# EAGLE design Rpi3Shield (EAGLE 9.3.0)
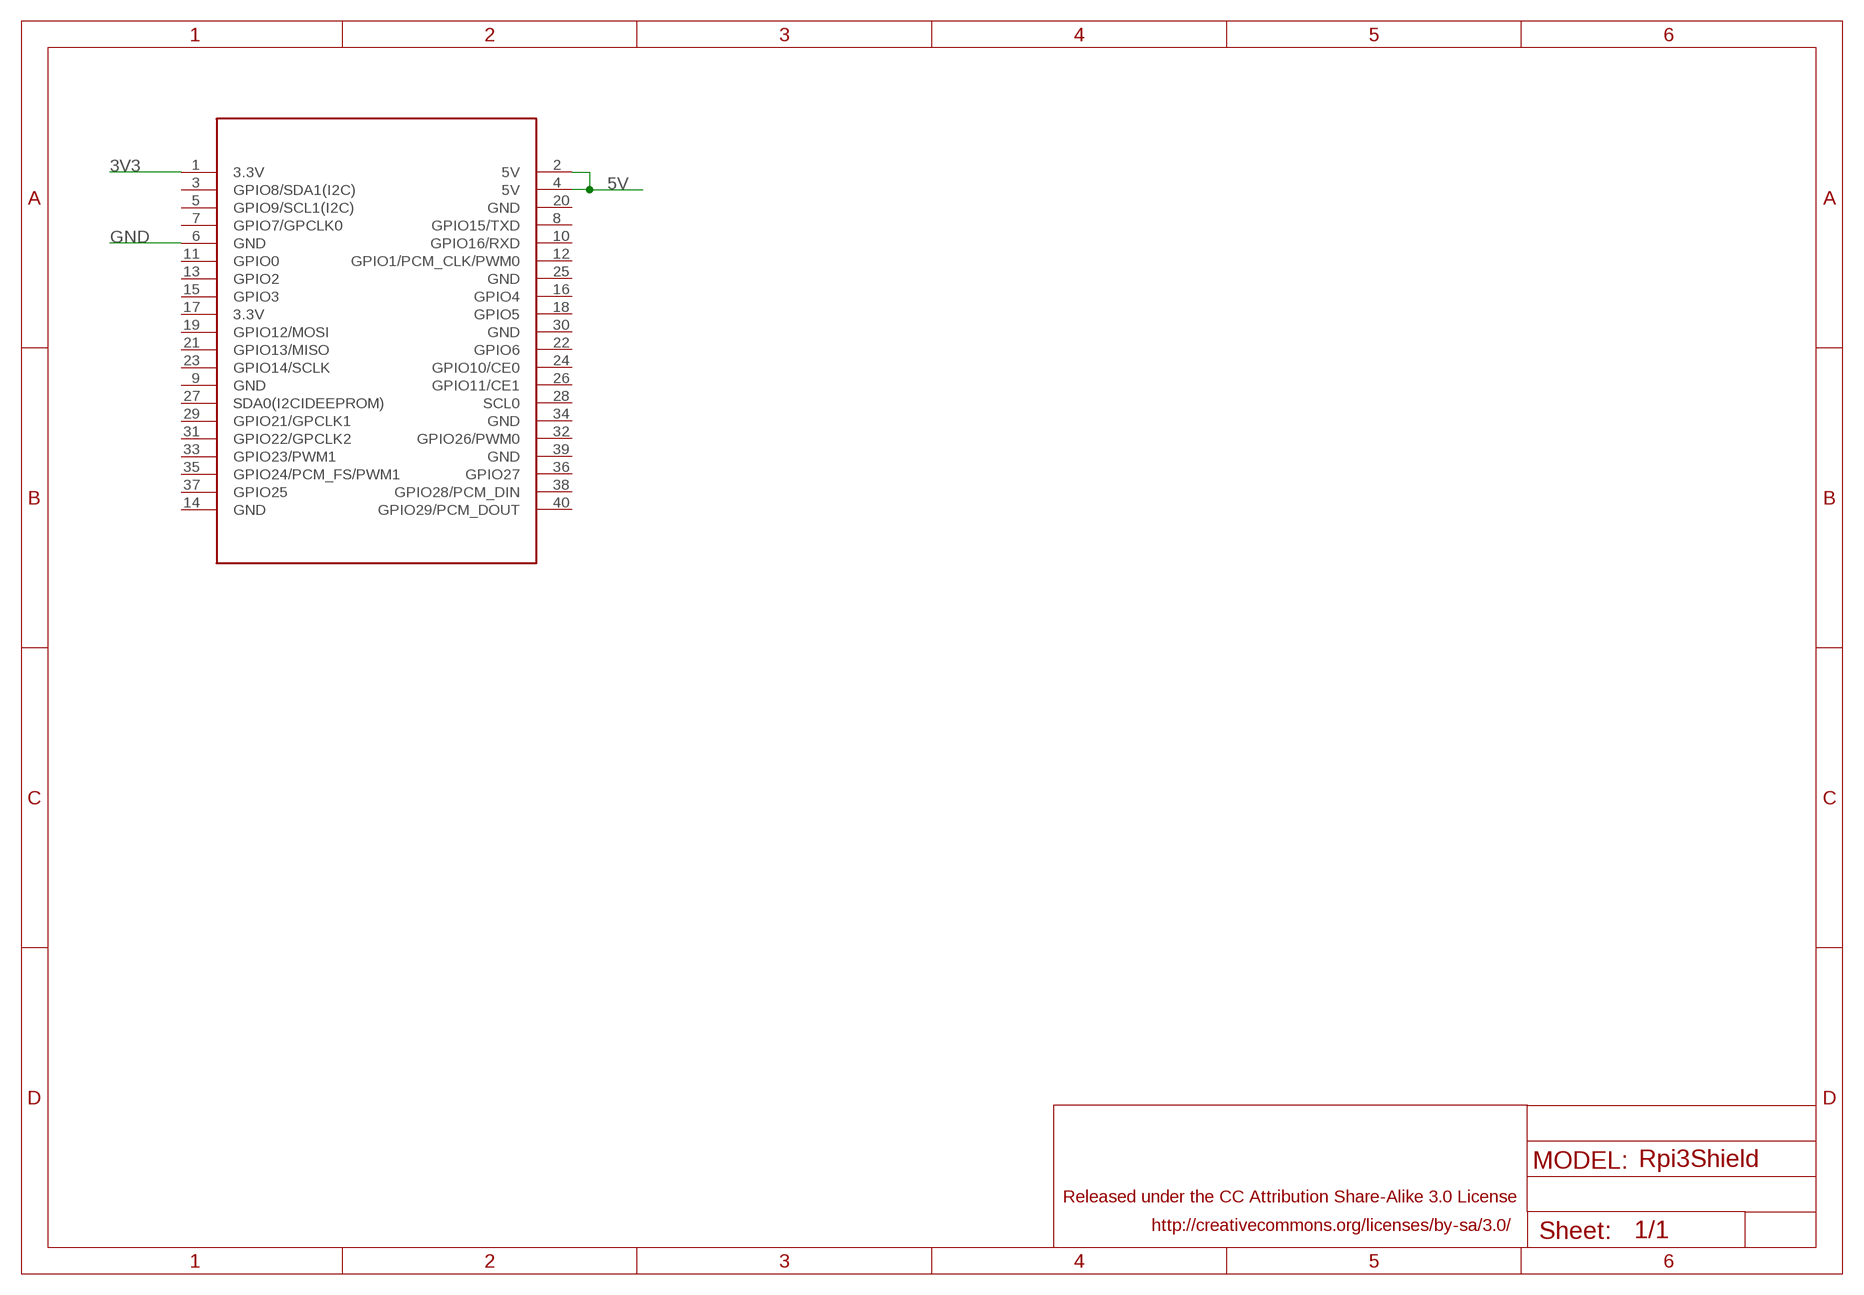
[diagram p0: schematic, sheet 1]

## Parts
U$2  RPILORASHIELD  [RPILORASHIELD]

## Nets
3V3: U$2.1(3.3V)
5V: U$2.2(5V) U$2.4(5V)
GND: U$2.6(GND)
Unconnected: U$2.3(GPIO8/SDA1(I2C)) U$2.5(GPIO9/SCL1(I2C)) U$2.7(GPIO7/GPCLK0) U$2.8(GPIO15/TXD) U$2.9(GND) U$2.10(GPIO16/RXD) U$2.11(GPIO0) U$2.12(GPIO1/PCM_CLK/PWM0) U$2.13(GPIO2) U$2.14(GND) U$2.15(GPIO3) U$2.16(GPIO4) U$2.17(3.3V) U$2.18(GPIO5) U$2.19(GPIO12/MOSI) U$2.20(GND) U$2.21(GPIO13/MISO) U$2.22(GPIO6) U$2.23(GPIO14/SCLK) U$2.24(GPIO10/CE0) U$2.25(GND) U$2.26(GPIO11/CE1) U$2.27(SDA0(I2CIDEEPROM)) U$2.28(SCL0) U$2.29(GPIO21/GPCLK1) U$2.30(GND) U$2.31(GPIO22/GPCLK2) U$2.32(GPIO26/PWM0) U$2.33(GPIO23/PWM1) U$2.34(GND) U$2.35(GPIO24/PCM_FS/PWM1) U$2.36(GPIO27) U$2.37(GPIO25) U$2.38(GPIO28/PCM_DIN) U$2.39(GND) U$2.40(GPIO29/PCM_DOUT)

## Library data of the parts
U$2 = lorarpi:RPILORASHIELD

## Net classes
2 gnd: width 0.254 mm, drill 0.61 mm, clearance 0.254 mm

## Board
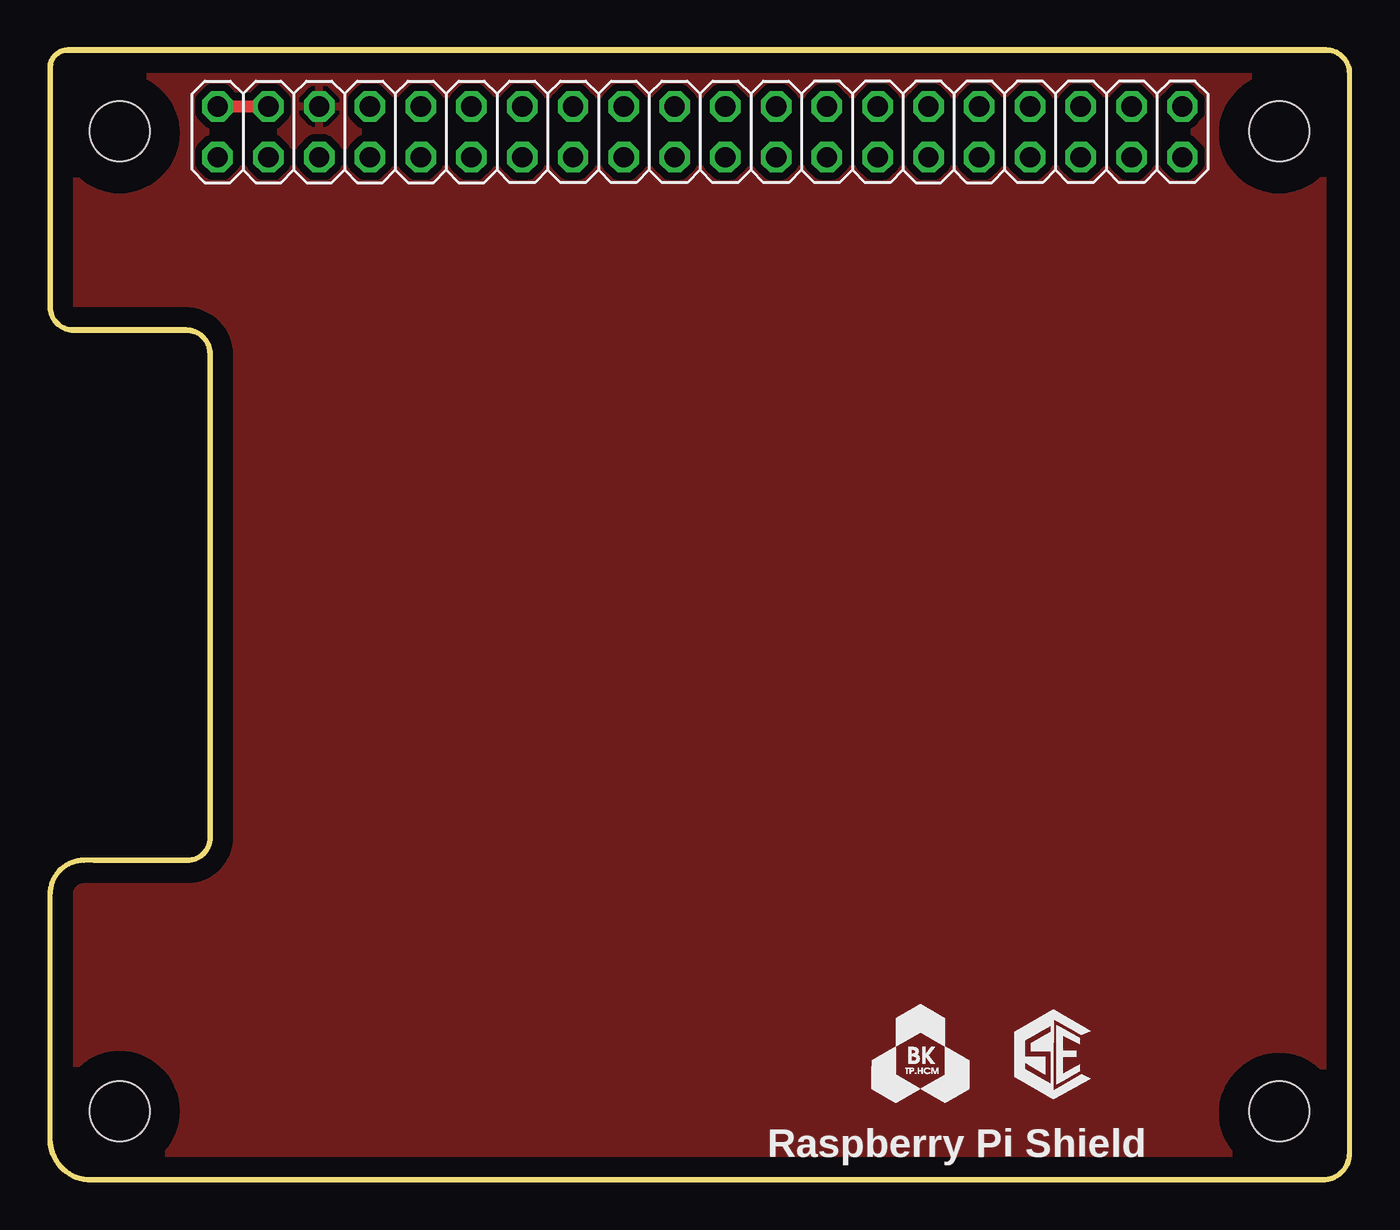
[diagram p1: board, top side]
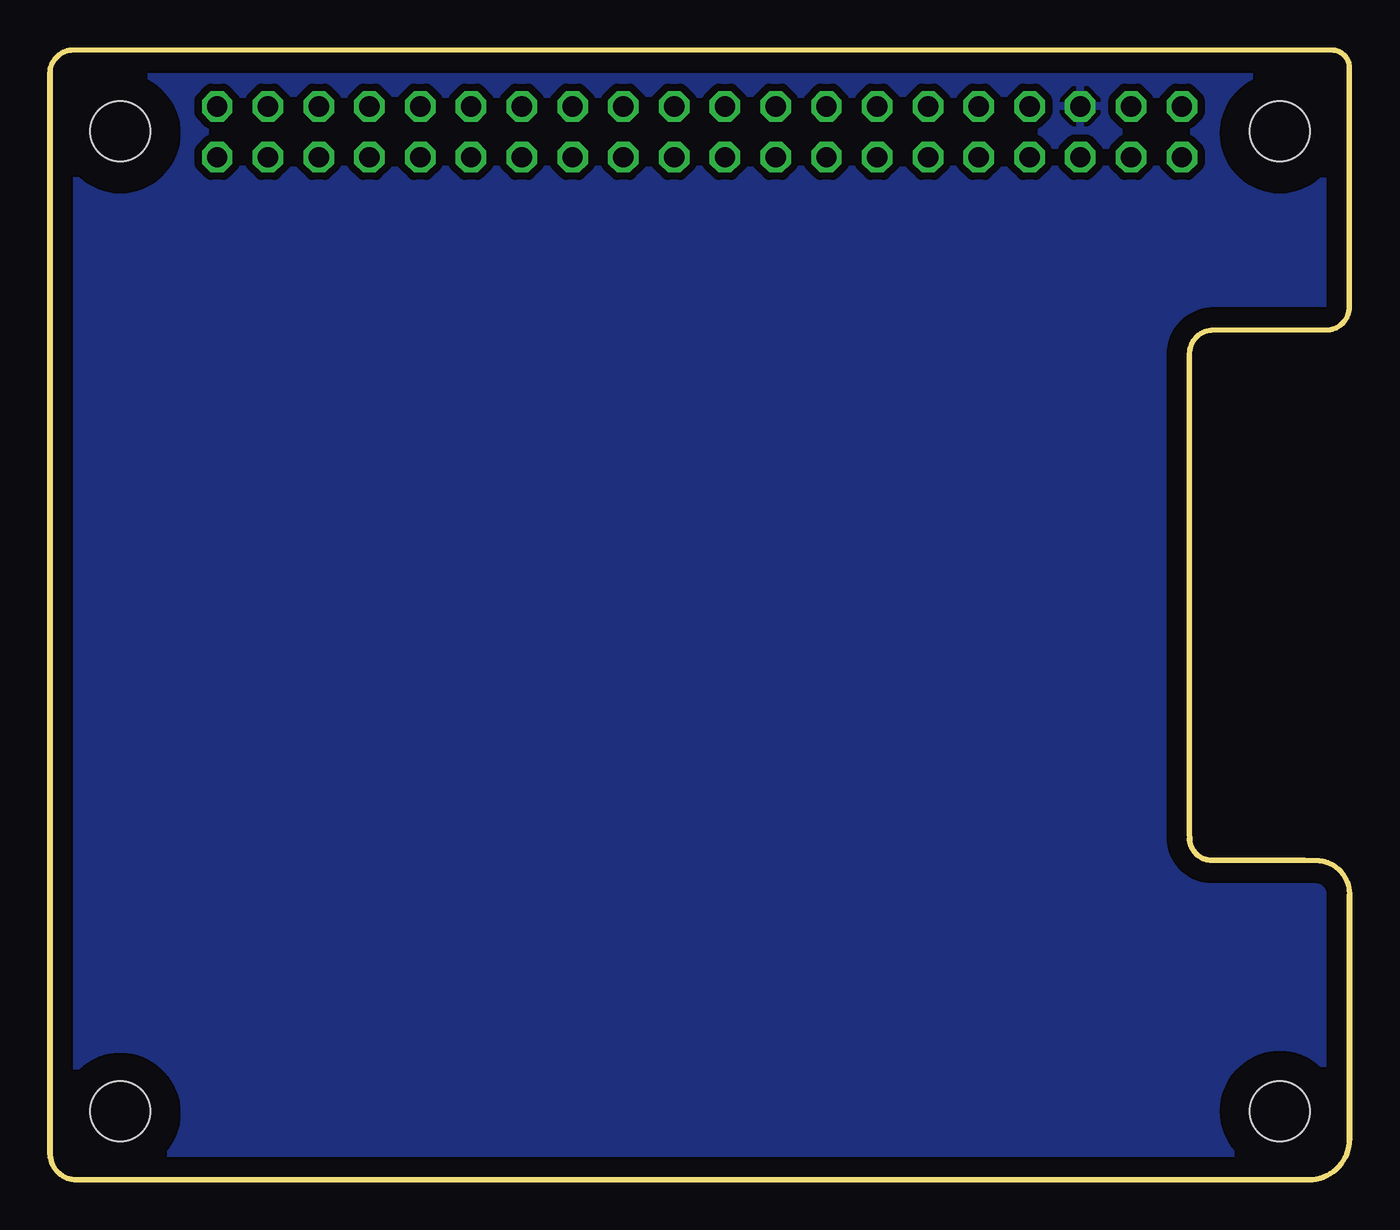
[diagram p2: board, bottom side, seen from below]

Size 65.01 x 56.5 mm. Coordinates in mm from the lower left corner, seen from the top.
Outline: 8,17.18 8,17.09 arc-90 6.88,15.98
Outline: 6.88,15.98 1.68,15.98 arc90 0,14.3 0,2.04 arc90 2.04,0 63.68,0 arc90 65.01,1.33 65.01,55.33 arc90 63.84,56.5 0.89,56.5 arc90 0.01,55.63 0.01,43.65 arc90 1.17,42.49 6.81,42.49 arc-90 8.01,41.29 8.01,17.11 arc-90 6.88,15.98
Copper layers (1*16): Top 0.035mm / dielectric 1.5mm / Bottom 0.035mm
Design rules "default *": minimum track width 10mil, minimum drill 12mil, track to track 6mil, track to pad 6mil, pad to pad 6mil, via to via 6mil, smd to smd 6mil, copper to edge 40mil, drill to drill 8mil, minimum pad ring 10mil, minimum via ring 8mil, stop-mask expansion 4mil, vias tented up to drill 30mil, thermal gap 10mil

### Footprints (pad centres in the part's own frame; a part is rotated, then mirrored left to right if it is on the bottom)
RPILORASHIELD = drill 1.016 octagon: 1 -24.1,23.2; 2 -24.1,25.74; 3 -21.56,23.2; 4 -21.56,25.74; 5 -19.02,23.2; 6 -19.02,25.74; 7 -16.48,23.2; 8 -16.48,25.74; 9 -13.94,23.2; 10 -13.94,25.74; 11 -11.4,23.2; 12 -11.4,25.74; 13 -8.86,23.2; 14 -8.86,25.74; 15 -6.32,23.2; 16 -6.32,25.74; 17 -3.78,23.2; 18 -3.78,25.74; 19 -1.24,23.2; 20 -1.24,25.74; 21 1.3,23.2; 22 1.3,25.74; 23 3.84,23.2; 24 3.84,25.74; 25 6.38,23.2; 26 6.38,25.74; 27 8.92,23.2; 28 8.92,25.74; 29 11.46,23.2; 30 11.46,25.74; 31 14,23.2; 32 14,25.74; 33 16.54,23.2; 34 16.54,25.74; 35 19.08,23.2; 36 19.08,25.74; 37 21.62,23.2; 38 21.62,25.74; 39 24.16,23.2; 40 24.16,25.74 | hole 3: -29,24.5; -29,-24.5; 29,24.5; 29,-24.5

### Placement (x,y rotation side)
U$2  32.49,27.94 0 top

### Tracks (layer width: path | path; a pad name or v marks a point on that pad's centre or on a via)
5V
  Top 0.61: U$2.2 U$2.4
GND
  pour Bottom (isolate 0.381): 0.1,56.52 0.1,42.42 8.1,42.42 8.1,16 0.1,16 0.1,0 65,0 65,56.52
  pour Top (isolate 0.381): -0.03,56.52 65,56.52 65,0 0.1,0 0.1,16 8.1,16 8.1,42.42 -0.03,42.42

### Text on the board
tNames: Raspberry Pi Shield